# EAGLE design FYP (EAGLE 9.6.2)
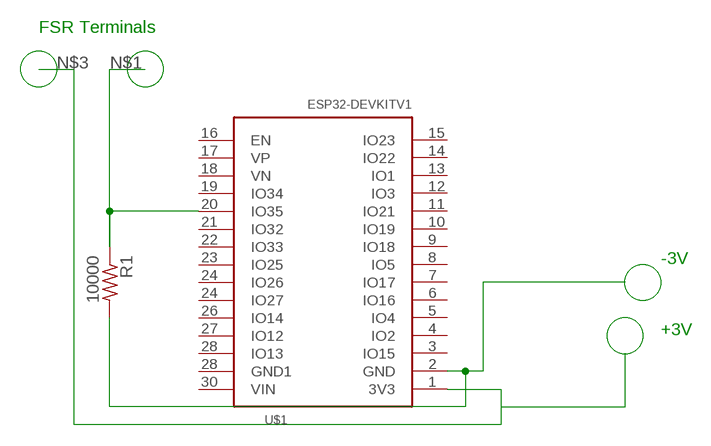
[diagram p0: schematic, sheet 1]

## Parts
R1  10000  R-US_0309/10  [0309/10]
U$1  ESP32DEVKITV1  [ESP32-DEVKITV1]

## Nets
N$1: R1.1 U$1.20(IO35)
N$2: R1.2 U$1.2(GND)
N$3: U$1.1(3V3)
Unconnected: U$1.3(IO15) U$1.4(IO2) U$1.5(IO4) U$1.6(IO16) U$1.7(IO17) U$1.8(IO5) U$1.9(IO18) U$1.10(IO19) U$1.11(IO21) U$1.12(IO3) U$1.13(IO1) U$1.14(IO22) U$1.15(IO23) U$1.16(EN) U$1.17(VP) U$1.18(VN) U$1.19(IO34) U$1.21(IO32) U$1.22(IO33) U$1.23(IO25) U$1.24(IO26) U$1.24(IO27) U$1.26(IO14) U$1.27(IO12) U$1.28(GND1) U$1.28(IO13) U$1.30(VIN)

## Notes on the sheet
- FSR Terminals
- -3V
- +3V

## Library data of the parts
R1 = rcl:R-US_: RESISTOR, American symbol; SPICEPREFIX: R
U$1 = ESP32-DEVKITV1:ESP32DEVKITV1

## Board
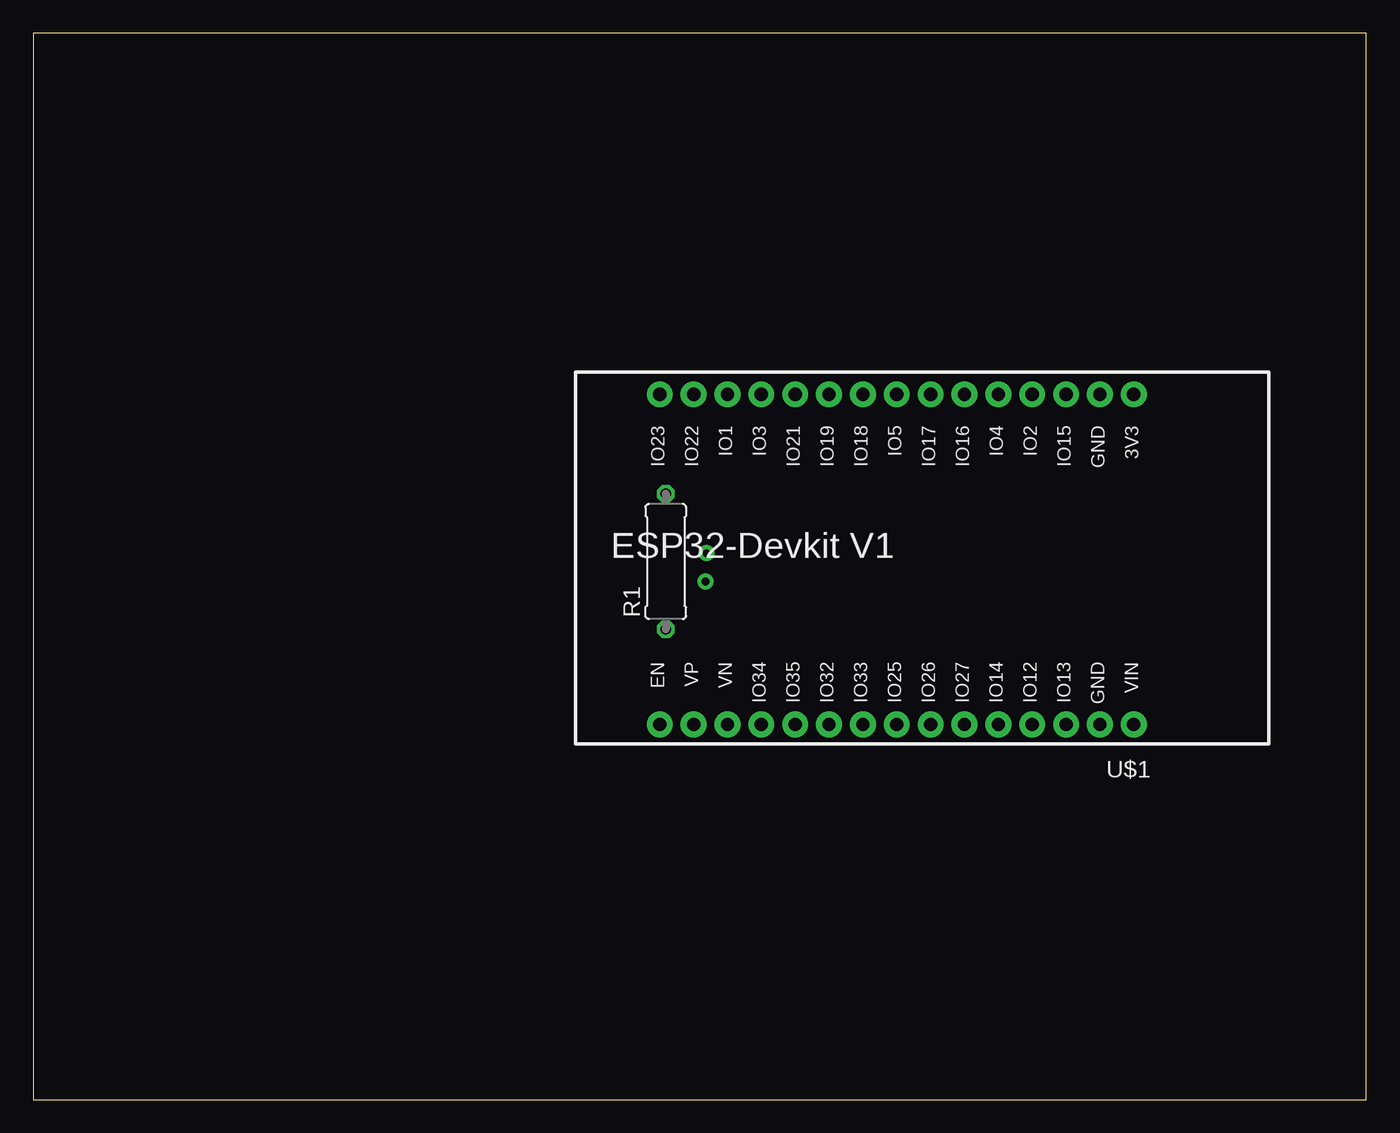
[diagram p1: board, top side]
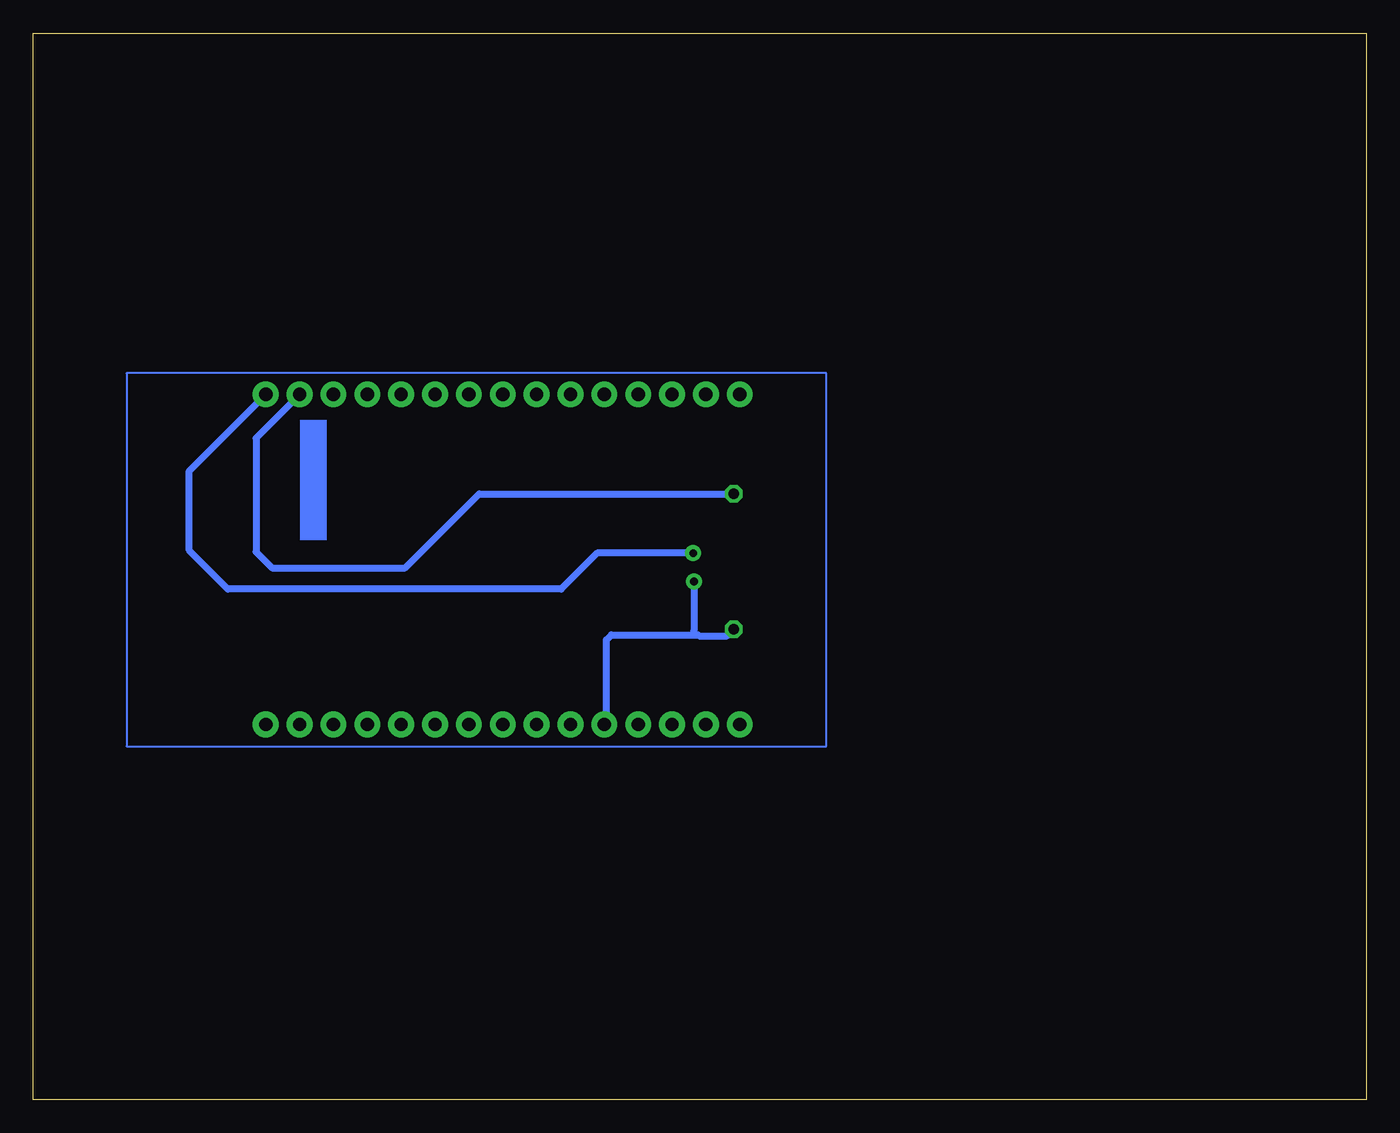
[diagram p2: board, bottom side, seen from below]

Size 100 x 80 mm. Coordinates in mm from the lower left corner, seen from the top.
Outline: 0,0 100,0 100,80 0,80 0,0
Copper layers (1*16): Top 0.035mm / dielectric 1.5mm / Bottom 0.035mm
Design rules "default": minimum track width 6mil, minimum drill 0.35mm, track to track 6mil, track to pad 6mil, pad to pad 6mil, via to via 6mil, smd to smd 6mil, copper to edge 40mil, drill to drill 6mil, minimum pad ring 10mil, minimum via ring 8mil, stop-mask expansion 4mil, vias tented up to drill 0mil, thermal gap 10mil

### Footprints (pad centres in the part's own frame; a part is rotated, then mirrored left to right if it is on the bottom)
0309/10 = drill 0.813 octagon: 1 -5.08,0; 2 5.08,0
ESP32-DEVKITV1 = drill 1 pad 1.93: 1 -22.87,-13.54; 2 -20.33,-13.54; 3 -17.79,-13.54; 4 -15.25,-13.54; 5 -12.71,-13.54; 6 -10.17,-13.54; 7 -7.63,-13.54; 8 -5.09,-13.54; 9 -2.55,-13.54; 10 -0.01,-13.54; 11 2.53,-13.54; 12 5.07,-13.54; 13 7.61,-13.54; 14 10.15,-13.54; 15 12.69,-13.54; 16 12.69,11.23; 17 10.15,11.23; 18 7.61,11.23; 19 5.07,11.23; 20 2.53,11.23; 21 -0.01,11.23; 22 -2.55,11.23; 23 -5.09,11.23; 24 -7.63,11.23; 25 -10.17,11.23; 26 -12.71,11.23; 27 -15.25,11.23; 28 -17.79,11.23; 29 -20.33,11.23; 30 -22.87,11.23

### Placement (x,y rotation side)
R1  47.45,40.37 90 top
U$1  59.69,39.37 180 top

### Tracks (layer width: path | path; a pad name or v marks a point on that pad's centre or on a via)
N$1  (via drill 0.6 pad 1.2)
  Bottom 0.152: U$1.20 56.7,28.14 | 50.44,35.18 50.13,34.87 50.05,34.79
  Bottom 0.508: 50.05,34.79 47.95,34.79 R1.1 | v50.44,38.86 50.44,35.18 | U$1.20 57,28.3 57,34.5 56.63,34.87 50.13,34.87
N$2
  Bottom 0.508: U$1.2 83.3,49.63 83.3,41.1 82.1,39.9 72.1,39.9 66.55,45.45 R1.2
N$3  (via drill 0.55 pad 1.2)
  Bottom 0.508: v50.5,41 57.7,41 60.4,38.3 85.4,38.3 88.3,41.2 88.3,47.17 U$1.1
N$4
  Bottom 0.152: 40.5,54.5 93,54.5 93,26.5 40.5,26.5 40.5,54.5
(copper drawn outside any net)
  shapes: Bottom area x1